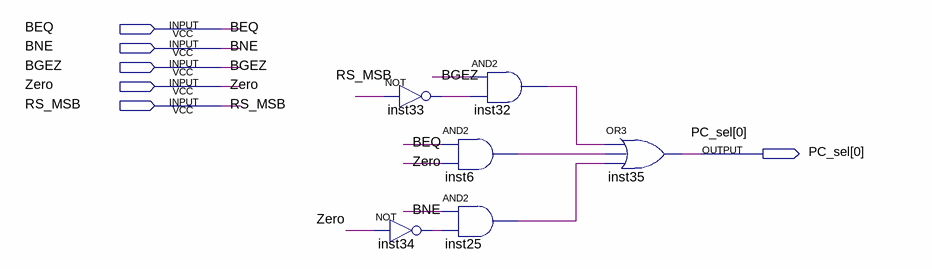
[diagram p0: schematic sheet]
// Quartus schematic Branch.bdf as structural Verilog: 6 symbols, 6 pins
module Branch (
  input  BEQ,
  input  BNE,
  input  BGEZ,
  input  Zero,
  input  RS_MSB,
  output [0:0] PC_sel
);

  wire inst6_out, inst25_out, inst32_out, inst33_out, inst34_out;

  not inst33 (inst33_out, RS_MSB);
  not inst34 (inst34_out, Zero);
  and inst32 (inst32_out, BGEZ, inst33_out);
  and inst6 (inst6_out, BEQ, Zero);
  and inst25 (inst25_out, BNE, inst34_out);
  or inst35 (PC_sel[0], inst32_out, inst6_out, inst25_out);
endmodule
